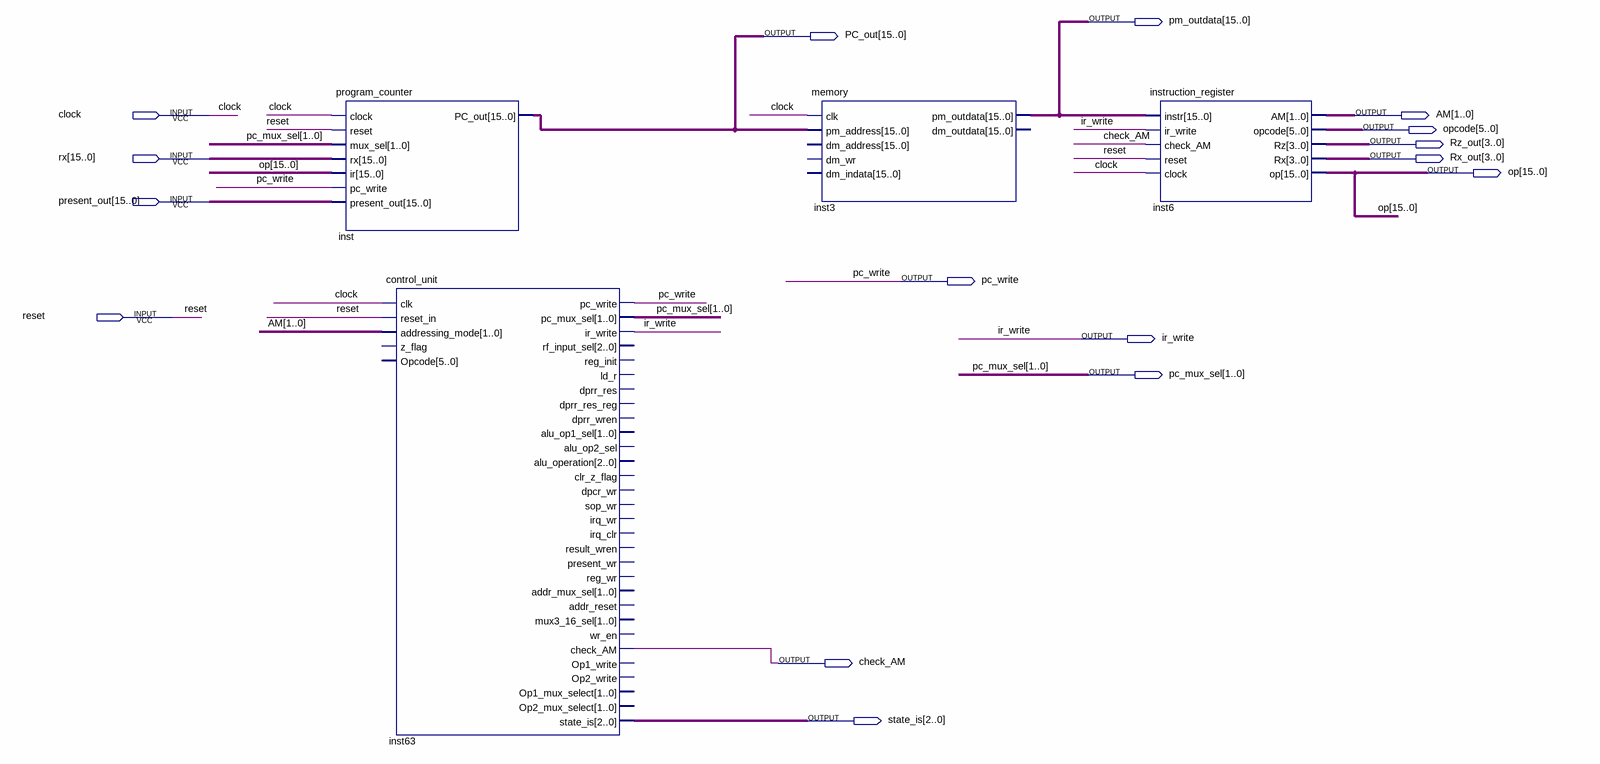
[diagram p0: schematic sheet]
// Quartus schematic fetch_with_control.bdf as structural Verilog: 4 symbols, 16 pins
module fetch_with_control (
  input  clock,
  input  [15:0] rx,
  input  [15:0] present_out,
  input  reset,
  output [15:0] pm_outdata,
  output [15:0] PC_out,
  output [1:0] AM,
  output [5:0] opcode,
  output [3:0] Rz_out,
  output [3:0] Rx_out,
  output [15:0] op,
  output pc_write,
  output ir_write,
  output [1:0] pc_mux_sel,
  output check_AM,
  output [2:0] state_is
);

  program_counter inst (
    .clock(clock), .reset(reset), .mux_sel(pc_mux_sel), .rx(rx), .ir(op), .pc_write(pc_write),
    .present_out(present_out), .PC_out(PC_out));
  control_unit inst63 (
    .clk(clock), .reset_in(reset), .addressing_mode(AM), .pc_write(pc_write), .pc_mux_sel(pc_mux_sel),
    .ir_write(ir_write), .check_AM(check_AM), .state_is(state_is));  // open: z_flag, Opcode, rf_input_sel, reg_init, ld_r, dprr_res, dprr_res_reg, dprr_wren, alu_op1_sel, alu_op2_sel, alu_operation, clr_z_flag, dpcr_wr, sop_wr, irq_wr, irq_clr, result_wren, present_wr, reg_wr, addr_mux_sel, addr_reset, mux3_16_sel, wr_en, Op1_write, Op2_write, Op1_mux_select, Op2_mux_select
  memory inst3 (
    .clk(clock), .pm_address(PC_out), .pm_outdata(pm_outdata));  // open: dm_address, dm_wr, dm_indata, dm_outdata
  instruction_register inst6 (
    .instr(pm_outdata), .ir_write(ir_write), .check_AM(check_AM), .reset(reset), .clock(clock), .AM(AM),
    .opcode(opcode), .Rz(Rz_out), .Rx(Rx_out), .op(op));
endmodule
